# Altium schematic sheet [03] - CONNECTORS_1.SchDoc
size A4; DocumentNumber: 4; SheetNumber: 4; SheetTotal: 9
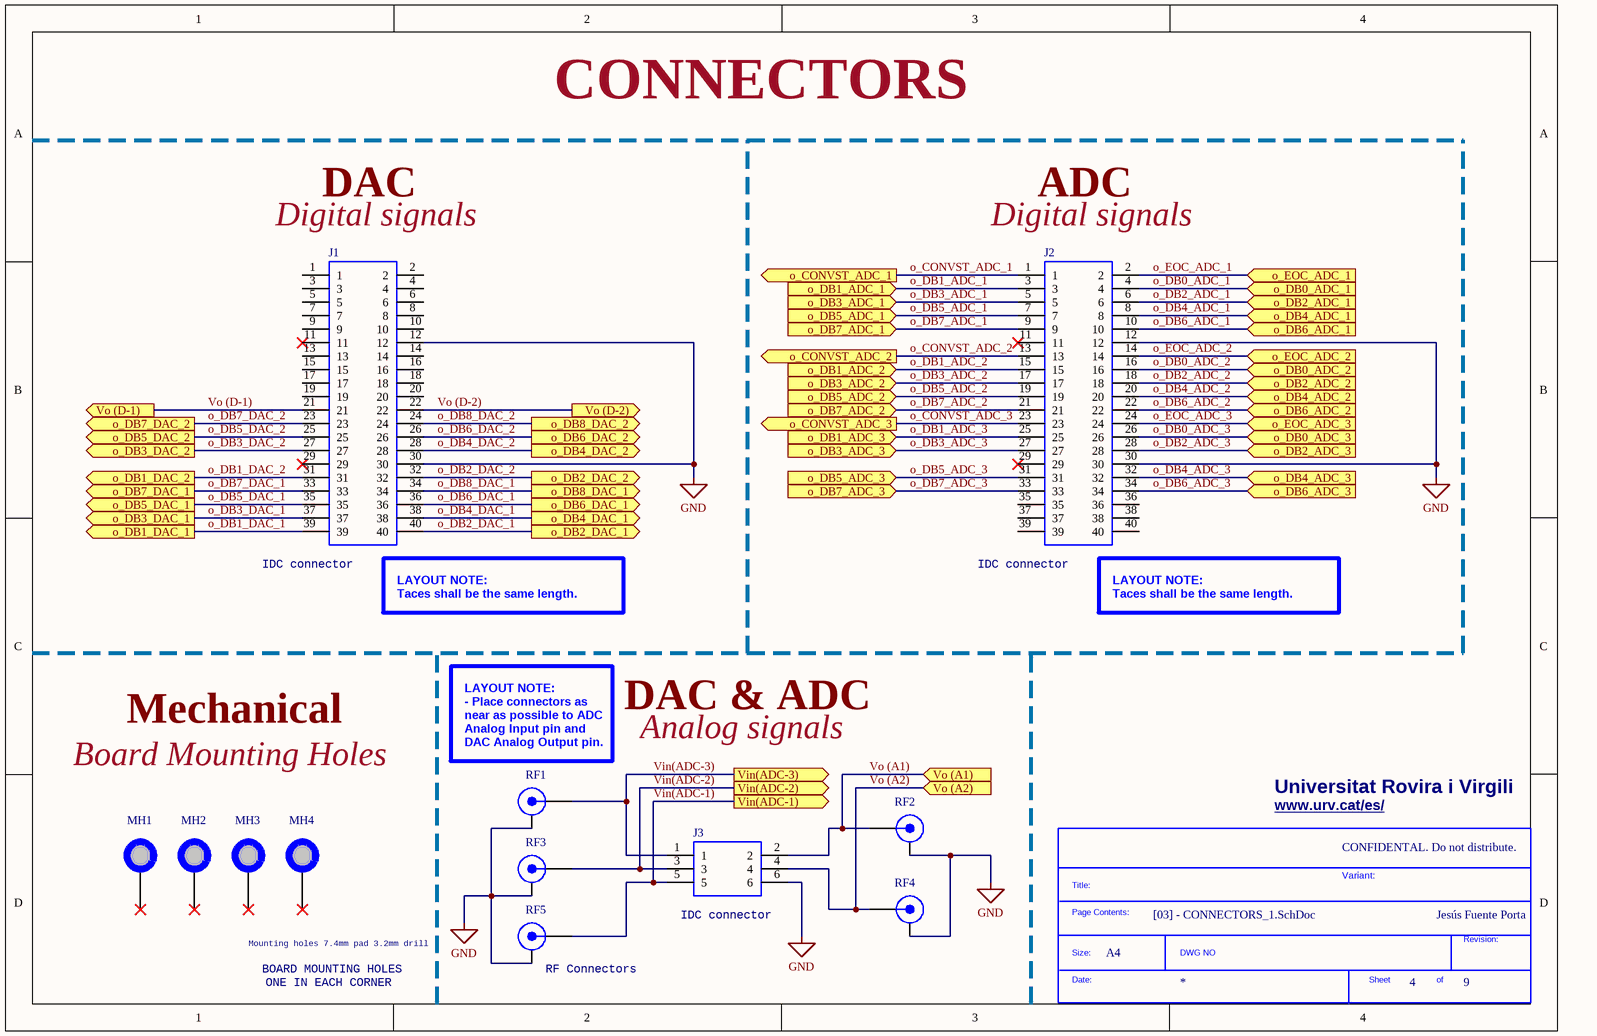
[diagram p0: [03] - CONNECTORS_1.SchDoc]

## Parts
*?  SDTitleBlock  (value not drawn)  (graphical)
J1  IDC Connector_40p  [IDC Connector - 40 pins]  (value not drawn)
J2  IDC Connector_40p  [IDC Connector - 40 pins]  (value not drawn)
J3  IDC Connector_6p  [IDC Connector - 6 pins]  (value not drawn)
MH1  MH_5.5MMC_3MMD  [MH_5.5MMC_3MMD]  (value not drawn)
MH2  MH_5.5MMC_3MMD  [MH_5.5MMC_3MMD]  (value not drawn)
MH3  MH_5.5MMC_3MMD  [MH_5.5MMC_3MMD]  (value not drawn)
MH4  MH_5.5MMC_3MMD  [MH_5.5MMC_3MMD]  (value not drawn)
RF1  85305-0232  [ROS-19S101-40ML5_V]  (value not drawn)
RF2  85305-0232  [ROS-19S101-40ML5_V]  (value not drawn)
RF3  85305-0232  [ROS-19S101-40ML5_V]  (value not drawn)
RF4  85305-0232  [ROS-19S101-40ML5_V]  (value not drawn)
RF5  85305-0232  [ROS-19S101-40ML5_V]  (value not drawn)

## Ports
o_CONVST_ADC_1 (out), o_CONVST_ADC_2 (out), o_CONVST_ADC_3 (out), o_DB0_ADC_1 (in), o_DB0_ADC_2 (in), o_DB0_ADC_3 (in), o_DB1_ADC_1 (in), o_DB1_ADC_2 (in), o_DB1_ADC_3 (in), o_DB1_DAC_1 (out), o_DB1_DAC_2 (out), o_DB2_ADC_1 (in), o_DB2_ADC_2 (in), o_DB2_ADC_3 (in), o_DB2_DAC_1 (out), o_DB2_DAC_2 (out), o_DB3_ADC_1 (in), o_DB3_ADC_2 (in), o_DB3_ADC_3 (in), o_DB3_DAC_1 (out), o_DB3_DAC_2 (out), o_DB4_ADC_1 (in), o_DB4_ADC_2 (in), o_DB4_ADC_3 (in), o_DB4_DAC_1 (out), o_DB4_DAC_2 (out), o_DB5_ADC_1 (in), o_DB5_ADC_2 (in), o_DB5_ADC_3 (in), o_DB5_DAC_1 (out), o_DB5_DAC_2 (out), o_DB6_ADC_1 (in), o_DB6_ADC_2 (in), o_DB6_ADC_3 (in), o_DB6_DAC_1 (out), o_DB6_DAC_2 (out), o_DB7_ADC_1 (in), o_DB7_ADC_2 (in), o_DB7_ADC_3 (in), o_DB7_DAC_1 (out), o_DB7_DAC_2 (out), o_DB8_DAC_1 (out), o_DB8_DAC_2 (out), o_EOC_ADC_1 (in), o_EOC_ADC_2 (in), o_EOC_ADC_3 (in), Vin(ADC-1) (out), Vin(ADC-2) (out), Vin(ADC-3) (out), Vo (A1) (in), Vo (A2) (in), Vo (D-1) (out), Vo (D-2) (out)

## Nets
GND: J1.12 J1.30 J2.12 J2.30 J3.6 RF1.MP RF2.MP RF3.MP RF4.MP RF5.MP
o_CONVST_ADC_1: J2.1 ; port o_CONVST_ADC_1
o_CONVST_ADC_2: J2.13 ; port o_CONVST_ADC_2
o_CONVST_ADC_3: J2.23 ; port o_CONVST_ADC_3
o_DB0_ADC_1: J2.4 ; port o_DB0_ADC_1
o_DB0_ADC_2: J2.16 ; port o_DB0_ADC_2
o_DB0_ADC_3: J2.26 ; port o_DB0_ADC_3
o_DB1_ADC_1: J2.3 ; port o_DB1_ADC_1
o_DB1_ADC_2: J2.15 ; port o_DB1_ADC_2
o_DB1_ADC_3: J2.25 ; port o_DB1_ADC_3
o_DB1_DAC_1: J1.39 ; port o_DB1_DAC_1
o_DB1_DAC_2: J1.31 ; port o_DB1_DAC_2
o_DB2_ADC_1: J2.6 ; port o_DB2_ADC_1
o_DB2_ADC_2: J2.18 ; port o_DB2_ADC_2
o_DB2_ADC_3: J2.28 ; port o_DB2_ADC_3
o_DB2_DAC_1: J1.40 ; port o_DB2_DAC_1
o_DB2_DAC_2: J1.32 ; port o_DB2_DAC_2
o_DB3_ADC_1: J2.5 ; port o_DB3_ADC_1
o_DB3_ADC_2: J2.17 ; port o_DB3_ADC_2
o_DB3_ADC_3: J2.27 ; port o_DB3_ADC_3
o_DB3_DAC_1: J1.37 ; port o_DB3_DAC_1
o_DB3_DAC_2: J1.27 ; port o_DB3_DAC_2
o_DB4_ADC_1: J2.8 ; port o_DB4_ADC_1
o_DB4_ADC_2: J2.20 ; port o_DB4_ADC_2
o_DB4_ADC_3: J2.32 ; port o_DB4_ADC_3
o_DB4_DAC_1: J1.38 ; port o_DB4_DAC_1
o_DB4_DAC_2: J1.28 ; port o_DB4_DAC_2
o_DB5_ADC_1: J2.7 ; port o_DB5_ADC_1
o_DB5_ADC_2: J2.19 ; port o_DB5_ADC_2
o_DB5_ADC_3: J2.31 ; port o_DB5_ADC_3
o_DB5_DAC_1: J1.35 ; port o_DB5_DAC_1
o_DB5_DAC_2: J1.25 ; port o_DB5_DAC_2
o_DB6_ADC_1: J2.10 ; port o_DB6_ADC_1
o_DB6_ADC_2: J2.22 ; port o_DB6_ADC_2
o_DB6_ADC_3: J2.34 ; port o_DB6_ADC_3
o_DB6_DAC_1: J1.36 ; port o_DB6_DAC_1
o_DB6_DAC_2: J1.26 ; port o_DB6_DAC_2
o_DB7_ADC_1: J2.9 ; port o_DB7_ADC_1
o_DB7_ADC_2: J2.21 ; port o_DB7_ADC_2
o_DB7_ADC_3: J2.33 ; port o_DB7_ADC_3
o_DB7_DAC_1: J1.33 ; port o_DB7_DAC_1
o_DB7_DAC_2: J1.23 ; port o_DB7_DAC_2
o_DB8_DAC_1: J1.34 ; port o_DB8_DAC_1
o_DB8_DAC_2: J1.24 ; port o_DB8_DAC_2
o_EOC_ADC_1: J2.2 ; port o_EOC_ADC_1
o_EOC_ADC_2: J2.14 ; port o_EOC_ADC_2
o_EOC_ADC_3: J2.24 ; port o_EOC_ADC_3
Vin(ADC-1): J3.5 RF5.1 ; port Vin(ADC-1)
Vin(ADC-2): J3.3 RF3.1 ; port Vin(ADC-2)
Vin(ADC-3): J3.1 RF1.1 ; port Vin(ADC-3)
Vo (A1): J3.2 RF2.1 ; port Vo (A1)
Vo (A2): J3.4 RF4.1 ; port Vo (A2)
Vo (D-1): J1.21 ; port Vo (D-1)
Vo (D-2): J1.22 ; port Vo (D-2)

Not connected (* = marked no-connect by the designer): J1 1 2 3 4 5 6 7 8 9 10 11* 13 14 15 16 17 18 19 20 29*; J2 11* 29* 35 36 37 38 39 40; MH1 1*; MH2 1*; MH3 1*; MH4 1*

## Notes on the sheet
- CONNECTORS
- (near J1) Digital signals
- DAC
- (near J2) Digital signals
- ADC
- (near J1) IDC connector
- (near J2) IDC connector
- (near J1) LAYOUT NOTE:
  Taces shall be the same length.
- (near J2) LAYOUT NOTE:
  Taces shall be the same length.
- DAC & ADC
- Board Mounting Holes
- Mechanical
- (near RF1) LAYOUT NOTE:
  - Place connectors as near as possible to ADC Analog Input pin and DAC Analog Output pin.
- Analog signals
- Universitat Rovira i Virgili
- www.urv.cat/es/ <http://www.urv.cat/es/>
- CONFIDENTAL. Do not distribute.
- (near J3) IDC connector
- Variant:
- Jesús Fuente Porta
- Mounting holes 7.4mm pad 3.2mm drill
- BOARD MOUNTING HOLES
- ONE IN EACH CORNER
- (near RF5) RF Connectors
- A4
- (in symbol SDTitleBlock) Title:; Page Contents:; Revision:; Size:; DWG NO; Date:; Sheet; of

## Library data of the parts
J1 J2 = IDC Connector_40p: MC-254-40-00-ST-DIP -  Conector de Cable a Placa, 2.54 mm, 40 Contactos, Header, Agujero Pasante, 2 Filas; Manufacturer_Name: RS Components; Manufacturer_Part_Number: 6257296; Geometry.Height: 8.9mm; RS Part Number: 6257296; Datasheet Link: https://componentsearchengine.com/Datasheets/3/6257296.pdf; ComponentLink1Description: Farnell Webpage; ComponentLink1URL: https://es.farnell.com/multicomp/mc-254-40-00-st-dip/conector-macho-40pos-2fila-2-54mm/dp/2843536
J3 = IDC Connector_6p: MC-254-06-00-ST-DIP -  Conector de Cable a Placa, 2.54 mm, 6 Contactos, Header, Agujero Pasante, 2 Filas; Manufacturer_Name: RS Components; Manufacturer_Part_Number: 6257296; Geometry.Height: 8.9mm; RS Part Number: 6257296; Datasheet Link: https://componentsearchengine.com/Datasheets/3/6257296.pdf; ComponentLink1Description: Farnell Webpage; ComponentLink1URL: https://es.farnell.com/multicomp/mc-254-06-00-st-dip/conector-macho-6pos-2fila-2-54mm/dp/2843525?ost=MC-254-06-00-ST-DIP&ddkey=https%3Aes-ES%2FElement14_Spain%2Fsearch
MH1-MH4 = MH_5.5MMC_3MMD: Mounting Hole 5,5 mm Diameter, 3 mm Drill; 30 mm body length / 05.13.301 -  Separador, Galvanizado, Acero, M3, Hexagonal, Macho-Hembra, 30 mm, 05.13 Series; Manufacturer: Ettinger; Supplier 1: Farnell; Manufacturer Part Number: 05.13.301; Stock 1: 5518; Pricing 1: 4=0.526, 50=0.504, 100=0.47 (EUR); Mount: External; Material: Steel; Length: 30mm; Thread Size: M3; REACH SVHC: No SVHC; ComponentLink1URL: http://www.farnell.com/datasheets/58394.pdf?src-supplier=Element14; ComponentLink1Description: http://www.farnell.com/datasheets/58394.pdf?src-supplier=Element14; Supplier Part Number 1: 1466817
RF1-RF5 = 85305-0232: 85305-0232 -  Conector de RF / Coaxial, Coaxial SMP, Macho Recto, Montaje Superficial Vertical, 50 ohm, Latón; PartNumber: 19S101-40ML5; Detention force: limited detent; Lock-in Range: small; Design Note: Footprint in library is a generic example - only application specific footprint delivers High Performance; DatasheetVersion: a00; PackageVersion: a00; PackageReference: 19S101-40ML5; PackageDescription: SMP Straight Plug Limited Detent, Small, 6 x 5 x 4.1 mm; Mounting Technology: Surface Mount; ComponentLink1Description: Farnell Webpage; ComponentLink1URL: https://es.farnell.com/molex/85305-0232/coax-rf-smp-macho-50-ohm-pcb/dp/2396235; ComponentLink2Description: Datasheet; ComponentLink2URL: http://rosenberger.de/ok/images/documents/db/19S101-40ML5.pdf; ComponentLink3Description: Package Specification; ComponentLink3URL: http://rosenberger.de/ok/images/documents/db/19S101-40ML5.pdf; ComponentLink4Description: Series Overview / Design Note; ComponentLink4URL: http://rosenberger.de/ok/images/documents/spez/19.pdf